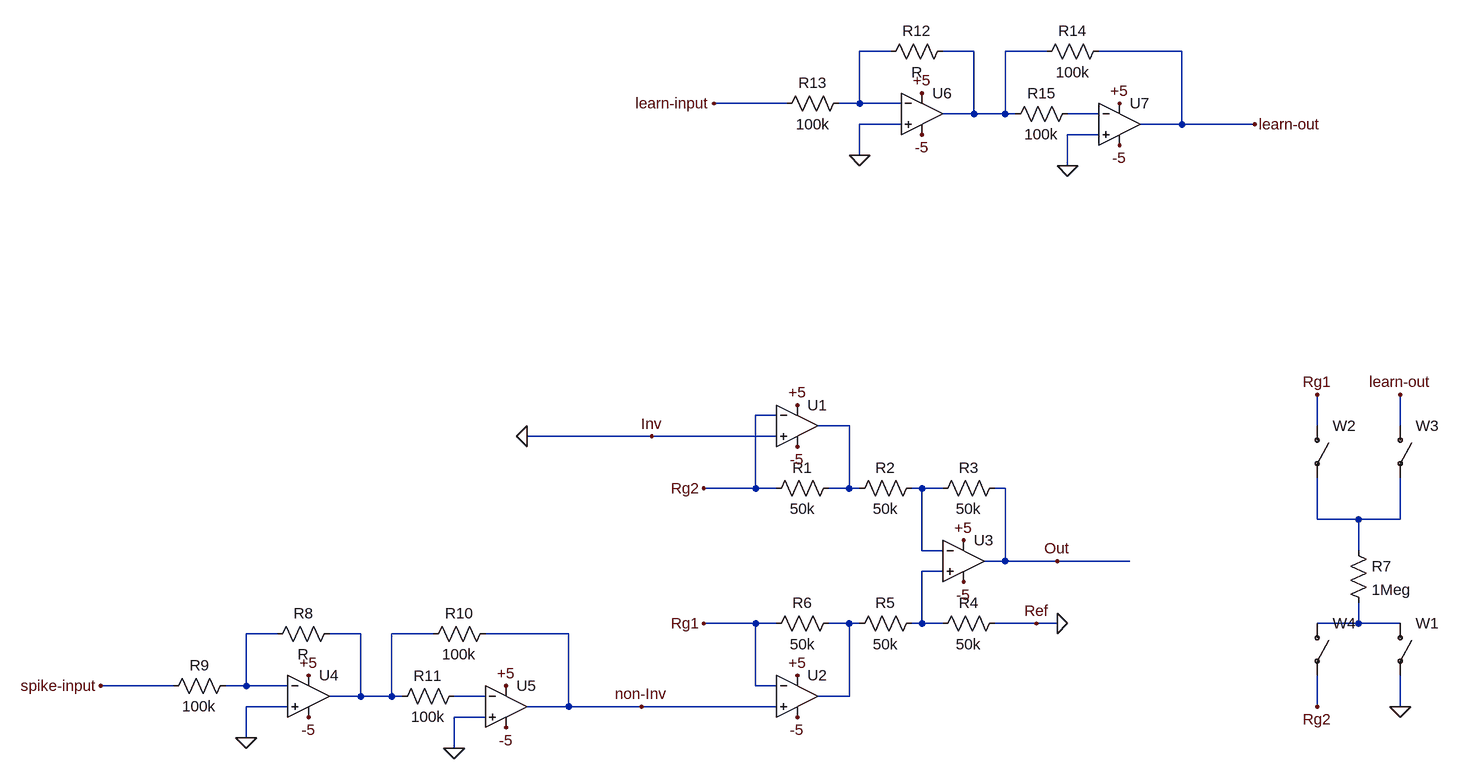
[diagram p0: schematic Memristor_dev.asc]
Memristor_dev.asc, the LTspice schematic file:
Version 4
SHEET 1 1040 680
WIRE -240 -496 -288 -496
WIRE -112 -496 -160 -496
WIRE 0 -496 -64 -496
WIRE 208 -496 80 -496
WIRE -400 -416 -512 -416
WIRE -288 -416 -288 -496
WIRE -288 -416 -320 -416
WIRE -224 -416 -288 -416
WIRE -112 -400 -112 -496
WIRE -112 -400 -160 -400
WIRE -64 -400 -64 -496
WIRE -64 -400 -112 -400
WIRE -48 -400 -64 -400
WIRE 80 -400 32 -400
WIRE -224 -384 -288 -384
WIRE 208 -384 208 -496
WIRE 208 -384 144 -384
WIRE 320 -384 208 -384
WIRE 80 -368 32 -368
WIRE -288 -336 -288 -384
WIRE 32 -320 32 -368
WIRE -416 64 -448 64
WIRE -304 80 -352 80
WIRE 416 80 416 32
WIRE 544 80 544 32
WIRE -608 96 -800 96
WIRE -416 96 -608 96
WIRE -448 176 -448 64
WIRE -448 176 -528 176
WIRE -416 176 -448 176
WIRE -304 176 -304 80
WIRE -304 176 -336 176
WIRE -288 176 -304 176
WIRE -192 176 -208 176
WIRE -160 176 -192 176
WIRE -64 176 -80 176
WIRE 416 224 416 160
WIRE 480 224 416 224
WIRE 544 224 544 160
WIRE 544 224 480 224
WIRE -192 272 -192 176
WIRE -160 272 -192 272
WIRE 480 272 480 224
WIRE -64 288 -64 176
WIRE -64 288 -96 288
WIRE 16 288 -64 288
WIRE 128 288 16 288
WIRE -160 304 -192 304
WIRE -448 384 -528 384
WIRE -416 384 -448 384
WIRE -304 384 -336 384
WIRE -288 384 -304 384
WIRE -192 384 -192 304
WIRE -192 384 -208 384
WIRE -160 384 -192 384
WIRE -16 384 -80 384
WIRE 16 384 -16 384
WIRE 480 384 480 352
WIRE 480 384 416 384
WIRE 544 384 480 384
WIRE -1184 400 -1232 400
WIRE -1056 400 -1104 400
WIRE -944 400 -1008 400
WIRE -736 400 -864 400
WIRE -1344 480 -1456 480
WIRE -1232 480 -1232 400
WIRE -1232 480 -1264 480
WIRE -1168 480 -1232 480
WIRE -448 480 -448 384
WIRE -416 480 -448 480
WIRE -1056 496 -1056 400
WIRE -1056 496 -1104 496
WIRE -1008 496 -1008 400
WIRE -1008 496 -1056 496
WIRE -992 496 -1008 496
WIRE -864 496 -912 496
WIRE -304 496 -304 384
WIRE -304 496 -352 496
WIRE -1168 512 -1232 512
WIRE -736 512 -736 400
WIRE -736 512 -800 512
WIRE -624 512 -736 512
WIRE -416 512 -624 512
WIRE 416 512 416 464
WIRE 544 512 544 464
WIRE -864 528 -912 528
WIRE -1232 560 -1232 512
WIRE -912 576 -912 528
FLAG -528 384 Rg1
FLAG -528 176 Rg2
FLAG 16 288 Out
FLAG -608 96 Inv
FLAG -624 512 non-Inv
FLAG 544 32 learn-out
FLAG 544 512 0
FLAG 416 32 Rg1
FLAG 416 512 Rg2
FLAG -1232 560 0
FLAG -912 576 0
FLAG -1136 464 +5
FLAG -832 480 +5
FLAG -384 48 +5
FLAG -384 464 +5
FLAG -128 256 +5
FLAG -1136 528 -5
FLAG -832 544 -5
FLAG -128 320 -5
FLAG -384 112 -5
FLAG -384 528 -5
FLAG -288 -336 0
FLAG 32 -320 0
FLAG -192 -432 +5
FLAG 112 -416 +5
FLAG -192 -368 -5
FLAG 112 -352 -5
FLAG -512 -416 learn-input
FLAG 320 -384 learn-out
FLAG -1456 480 spike-input
FLAG -800 96 0
FLAG 16 384 0
FLAG -16 384 Ref
SYMBOL csw 544 384 R0
WINDOW 3 24 88 Invisible 2
SYMATTR InstName W1
SYMBOL Opamps\\UniversalOpamp2 -384 80 R0
SYMATTR InstName U1
SYMBOL Opamps\\UniversalOpamp2 -384 496 R0
SYMATTR InstName U2
SYMBOL Opamps\\UniversalOpamp2 -128 288 R0
SYMATTR InstName U3
SYMBOL res -320 160 R90
WINDOW 0 0 56 VBottom 2
WINDOW 3 32 56 VTop 2
SYMATTR InstName R1
SYMATTR Value 50k
SYMBOL res -192 160 R90
WINDOW 0 0 56 VBottom 2
WINDOW 3 32 56 VTop 2
SYMATTR InstName R2
SYMATTR Value 50k
SYMBOL res -64 160 R90
WINDOW 0 0 56 VBottom 2
WINDOW 3 32 56 VTop 2
SYMATTR InstName R3
SYMATTR Value 50k
SYMBOL res -64 368 R90
WINDOW 0 0 56 VBottom 2
WINDOW 3 32 56 VTop 2
SYMATTR InstName R4
SYMATTR Value 50k
SYMBOL res -192 368 R90
WINDOW 0 0 56 VBottom 2
WINDOW 3 32 56 VTop 2
SYMATTR InstName R5
SYMATTR Value 50k
SYMBOL res -320 368 R90
WINDOW 0 0 56 VBottom 2
WINDOW 3 32 56 VTop 2
SYMATTR InstName R6
SYMATTR Value 50k
SYMBOL res 464 256 R0
SYMATTR InstName R7
SYMATTR Value 1Meg
SYMBOL csw 416 80 R0
WINDOW 3 24 88 Invisible 2
SYMATTR InstName W2
SYMBOL csw 544 80 R0
WINDOW 3 24 88 Invisible 2
SYMATTR InstName W3
SYMBOL csw 416 384 R0
WINDOW 3 24 88 Invisible 2
SYMATTR InstName W4
SYMBOL Opamps\\UniversalOpamp2 -1136 496 R0
SYMATTR InstName U4
SYMBOL Opamps\\UniversalOpamp2 -832 512 R0
SYMATTR InstName U5
SYMBOL res -1088 384 R90
WINDOW 0 0 56 VBottom 2
WINDOW 3 32 56 VTop 2
SYMATTR InstName R8
SYMBOL res -1248 464 R90
WINDOW 0 0 56 VBottom 2
WINDOW 3 32 56 VTop 2
SYMATTR InstName R9
SYMATTR Value 100k
SYMBOL res -848 384 R90
WINDOW 0 0 56 VBottom 2
WINDOW 3 32 56 VTop 2
SYMATTR InstName R10
SYMATTR Value 100k
SYMBOL res -896 480 R90
WINDOW 0 0 56 VBottom 2
WINDOW 3 32 56 VTop 2
SYMATTR InstName R11
SYMATTR Value 100k
SYMBOL Opamps\\UniversalOpamp2 -192 -400 R0
SYMATTR InstName U6
SYMBOL Opamps\\UniversalOpamp2 112 -384 R0
SYMATTR InstName U7
SYMBOL res -144 -512 R90
WINDOW 0 0 56 VBottom 2
WINDOW 3 32 56 VTop 2
SYMATTR InstName R12
SYMBOL res -304 -432 R90
WINDOW 0 0 56 VBottom 2
WINDOW 3 32 56 VTop 2
SYMATTR InstName R13
SYMATTR Value 100k
SYMBOL res 96 -512 R90
WINDOW 0 0 56 VBottom 2
WINDOW 3 32 56 VTop 2
SYMATTR InstName R14
SYMATTR Value 100k
SYMBOL res 48 -416 R90
WINDOW 0 0 56 VBottom 2
WINDOW 3 32 56 VTop 2
SYMATTR InstName R15
SYMATTR Value 100k

The netlist it stands for:
* Memristor_dev.asc
W1 N009 0 CSW
XU1 0 Rg2 +5 -5 N004 level.2 Avol=1Meg GBW=10Meg Slew=10Meg ilimit=25m rail=0 Vos=0 phimargin=45 en=0 enk=0 in=0 ink=0 Rin=500Meg  ; pins IN+ IN- V+ V- OUT
XU2 non-Inv Rg1 +5 -5 N008 level.2 Avol=1Meg GBW=10Meg Slew=10Meg ilimit=25m rail=0 Vos=0 phimargin=45 en=0 enk=0 in=0 ink=0 Rin=500Meg  ; pins IN+ IN- V+ V- OUT
XU3 N007 N005 +5 -5 Out level.2 Avol=1Meg GBW=10Meg Slew=10Meg ilimit=25m rail=0 Vos=0 phimargin=45 en=0 enk=0 in=0 ink=0 Rin=500Meg  ; pins IN+ IN- V+ V- OUT
R1 N004 Rg2 50k
R2 N005 N004 50k
R3 Out N005 50k
R4 0 N007 50k
R5 N007 N008 50k
R6 N008 Rg1 50k
R7 N006 N009 1Meg
W2 Rg1 N006 CSW
W3 learn-out N006 CSW
W4 N009 Rg2 CSW
XU4 0 N010 +5 -5 N011 level.2 Avol=1Meg GBW=10Meg Slew=10Meg ilimit=25m rail=0 Vos=0 phimargin=45 en=0 enk=0 in=0 ink=0 Rin=500Meg  ; pins IN+ IN- V+ V- OUT
XU5 0 N012 +5 -5 non-Inv level.2 Avol=1Meg GBW=10Meg Slew=10Meg ilimit=25m rail=0 Vos=0 phimargin=45 en=0 enk=0 in=0 ink=0 Rin=500Meg  ; pins IN+ IN- V+ V- OUT
R8 N011 N010 R
R9 N010 spike-input 100k
R10 non-Inv N011 100k
R11 N012 N011 100k
XU6 0 N001 +5 -5 N002 level.2 Avol=1Meg GBW=10Meg Slew=10Meg ilimit=25m rail=0 Vos=0 phimargin=45 en=0 enk=0 in=0 ink=0 Rin=500Meg  ; pins IN+ IN- V+ V- OUT
XU7 0 N003 +5 -5 learn-out level.2 Avol=1Meg GBW=10Meg Slew=10Meg ilimit=25m rail=0 Vos=0 phimargin=45 en=0 enk=0 in=0 ink=0 Rin=500Meg  ; pins IN+ IN- V+ V- OUT
R12 N002 N001 R
R13 N001 learn-input 100k
R14 learn-out N002 100k
R15 N003 N002 100k
.lib UniversalOpamps2.sub
.backanno
.end